# EAGLE design Logomatic (EAGLE 7.4.0)
DESIGNER: Chris Taylor; REVISOR: Revised by: Toni Klopfenstein & Brent Wilkins; VERSION: v2.8

## Sheet 1 of 2
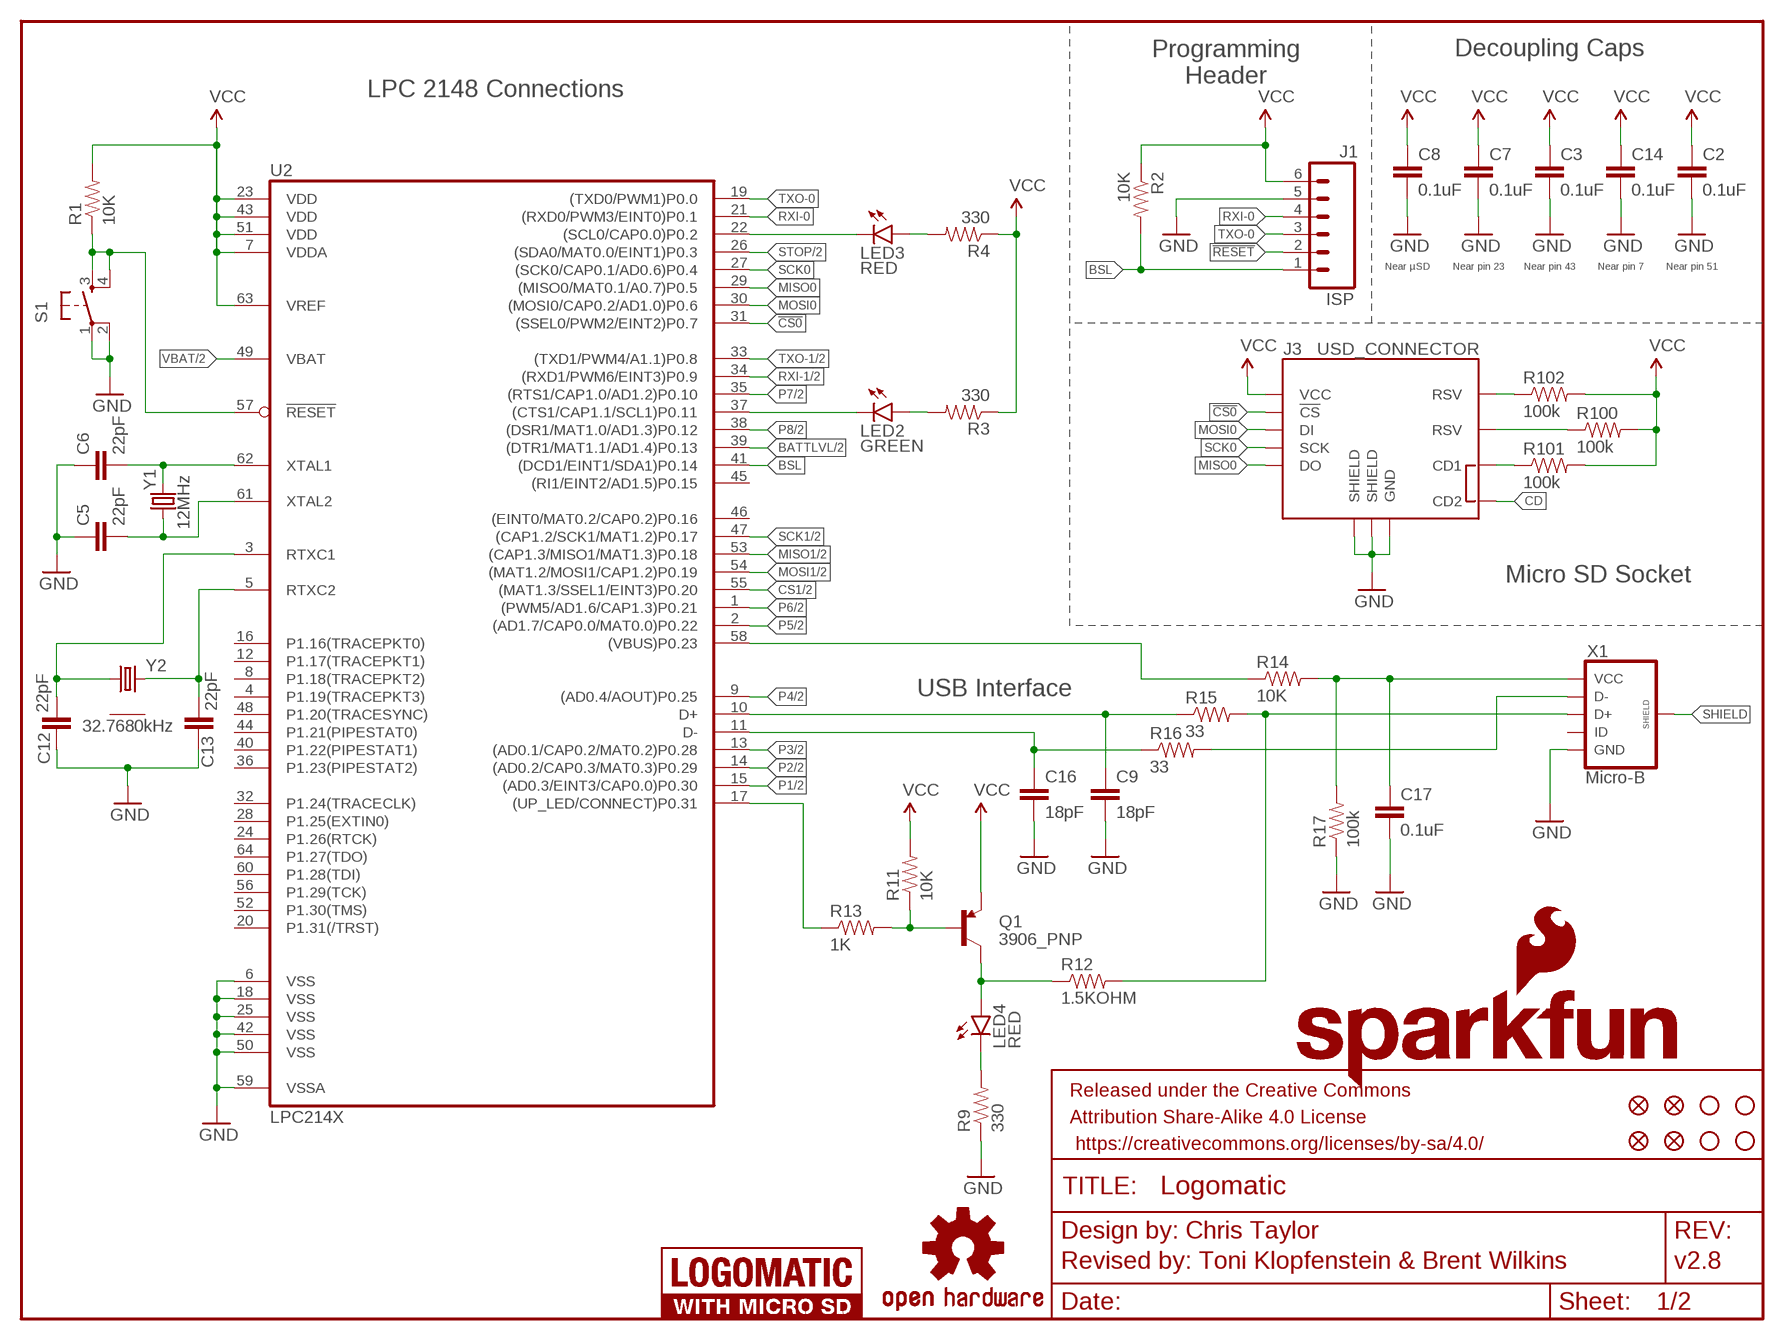
[diagram p0: schematic, sheet 1]

### Parts
C2  0.1uF  0.1UF-25V(+80/-20%)(0603)  [0603-CAP]
C3  0.1uF  0.1UF-25V(+80/-20%)(0603)  [0603-CAP]
C5  22pF  22PF-50V-5%(0603)  [0603-CAP]
C6  22pF  22PF-50V-5%(0603)  [0603-CAP]
C7  0.1uF  0.1UF-25V(+80/-20%)(0603)  [0603-CAP]
C8  0.1uF  0.1UF-25V(+80/-20%)(0603)  [0603-CAP]
C9  18pF  18PF-50V-5%(0603)  [0603-CAP]
C12  22pF  22PF-50V-5%(0603)  [0603-CAP]
C13  22pF  22PF-50V-5%(0603)  [0603-CAP]
C14  0.1uF  0.1UF-25V(+80/-20%)(0603)  [0603-CAP]
C16  18pF  18PF-50V-5%(0603)  [0603-CAP]
C17  0.1uF  0.1UF-25V(+80/-20%)(0603)  [0603-CAP]
FD1  FIDUCIAL1X2  [FIDUCIAL-1X2]
FD2  FIDUCIAL1X2  [FIDUCIAL-1X2]
FD100  FIDUCIAL1X2  [FIDUCIAL-1X2]
FD101  FIDUCIAL1X2  [FIDUCIAL-1X2]
FRAME1  FRAME-LETTER  [CREATIVE_COMMONS]
H1  STAND-OFF  [STAND-OFF]
H2  STAND-OFF  [STAND-OFF]
H3  STAND-OFF  [STAND-OFF]
H4  STAND-OFF  [STAND-OFF]
J1  ISP  M06SILK_FEMALE_PTH  [1X06]
J3  USD_CONNECTOR  [MICRO-SD-SOCKET-PP]
LED2  GREEN  LED-GREEN0603  [LED-0603]
LED3  RED  LED-RED0603  [LED-0603]
LED4  RED  LED-RED0603  [LED-0603]
LOGO1  SFE_LOGO_NAME.1_INCH  [SFE_LOGO_NAME_.1]
LOGO2  SFE_LOGO_FLAME.1_INCH  [SFE_LOGO_FLAME_.1]
LOGO100  OSHW-LOGOL  [OSHW-LOGO-L]
LOGO101  LOGOMATIC_LOGO  [LOGOMATIC_LOGO]
Q1  3906_PNP  TRANSISTOR_PNPPMBT3906  [SOT23-3]
R1  10K  10KOHM-1/10W-1%(0603)0603  [0603-RES]
R2  10K  10KOHM-1/10W-1%(0603)0603  [0603-RES]
R3  330  330OHM1/10W1%(0603)  [0603-RES]
R4  330  330OHM1/10W1%(0603)  [0603-RES]
R9  330  330OHM1/10W1%(0603)  [0603-RES]
R11  10K  10KOHM-1/10W-1%(0603)0603  [0603-RES]
R12  1.5KOHM  1.5KOHM-1/10W-1%(0603)  [0603]
R13  1K  1KOHM-1/10W-1%(0603)  [0603-RES]
R14  10K  10KOHM-1/10W-1%(0603)0603  [0603-RES]
R15  33  33OHM1/10W1%(0603)  [0603-RES]
R16  33  33OHM1/10W1%(0603)  [0603-RES]
R17  100k  100KOHM-1/10W-1%(0603)  [0603-RES]
R100  100k  100KOHM-1/10W-1%(0603)  [0603-RES]
R101  100k  100KOHM-1/10W-1%(0603)  [0603-RES]
R102  100k  100KOHM-1/10W-1%(0603)  [0603-RES]
S1  RESET  TAC_SWITCHSMD  [TACTILE-SWITCH-SMD]
U2  LPC214X  [LQFP-10X10-64]
X1  Micro-B  USB_MICROB_PLUGCONN-11752  [USB-B-MICRO-SMD_V03]
Y1  12MHz  CRYSTALCRYSTAL-SMD-5X3-12MHZ  [CRYSTAL-SMD-5X3]
Y2  32.7680kHz  RTC_CRYSTAL32-SMD  [4-SOJ_5.5MM]

### Nets
!CS0: J3.CS(!CS) U2.31((SSEL0/PWM2/EINT2)P0.7)
!RESET: J1.2 R1.1 S1.3 S1.4 U2.57(!RESET)
BATTLVL: U2.39((DTR1/MAT1.1/AD1.4)P0.13) ; also sheet 2
BSL: J1.1 R2.2 U2.41((DCD1/EINT1/SDA1)P0.14)
CD: J3.CD2
CS1: U2.55((MAT1.3/SSEL1/EINT3)P0.20) ; also sheet 2
GND [power]: C2.2 C3.2 C5.1 C6.1 C7.2 C8.2 C9.2 C12.1 C13.1 C14.2 C16.2 C17.2 J1.5 J3.GND J3.GND1(SHIELD) J3.GND3(SHIELD) R9.1 R17.1 S1.1 S1.2 U2.6(VSS) U2.18(VSS) U2.25(VSS) U2.42(VSS) U2.50(VSS) U2.59(VSSA) X1.GND ; also sheet 2
MISO0: J3.DO U2.29((MISO0/MAT0.1/A0.7)P0.5)
MISO1: U2.53((CAP1.3/MISO1/MAT1.3)P0.18) ; also sheet 2
MOSI0: J3.DI U2.30((MOSI0/CAP0.2/AD1.0)P0.6)
MOSI1: U2.54((MAT1.2/MOSI1/CAP1.2)P0.19) ; also sheet 2
N$3: J3.CD1 R101.1
N$4: J3.RSV1(RSV) R102.1
N$7: LED3.A R4.2
N$10: J3.RSV2(RSV) R100.1
N$17: Q1.1(B) R11.1 R13.2
N$19: LED2.A R3.2
N$33: LED4.C R9.2
P1: U2.15((AD0.3/EINT3/CAP0.0)P0.30) ; also sheet 2
P2: U2.14((AD0.2/CAP0.3/MAT0.3)P0.29) ; also sheet 2
P3: U2.13((AD0.1/CAP0.2/MAT0.2)P0.28) ; also sheet 2
P4: U2.9((AD0.4/AOUT)P0.25) ; also sheet 2
P5: U2.2((AD1.7/CAP0.0/MAT0.0)P0.22) ; also sheet 2
P6: U2.1((PWM5/AD1.6/CAP1.3)P0.21) ; also sheet 2
P7: U2.35((RTS1/CAP1.0/AD1.2)P0.10) ; also sheet 2
P8: U2.38((DSR1/MAT1.0/AD1.3)P0.12) ; also sheet 2
P-D+: C9.1 R15.1 U2.10(D+)
P-D-: C16.1 R16.1 U2.11(D-)
RTXC1: C12.2 U2.3(RTXC1) Y2.1
RTXC2: C13.2 U2.5(RTXC2) Y2.4
RXI-0: J1.4 U2.21((RXD0/PWM3/EINT0)P0.1)
RXI-1: U2.34((RXD1/PWM6/EINT3)P0.9) ; also sheet 2
SCK0: J3.SCLK(SCK) U2.27((SCK0/CAP0.1/AD0.6)P0.4)
SCK1: U2.47((CAP1.2/SCK1/MAT1.2)P0.17) ; also sheet 2
SHIELD: X1.SHIELD1(SHIELD) X1.SHIELD2(SHIELD) X1.SHIELD3(SHIELD)
STAT: LED4.A Q1.3(C) R12.1
STAT0: LED3.C U2.22((SCL0/CAP0.0)P0.2)
STAT1: LED2.C U2.37((CTS1/CAP1.1/SCL1)P0.11)
STOP: U2.26((SDA0/MAT0.0/EINT1)P0.3) ; also sheet 2
TXO-0: J1.3 U2.19((TXD0/PWM1)P0.0)
TXO-1: U2.33((TXD1/PWM4/A1.1)P0.8) ; also sheet 2
UP_LED: R13.1 U2.17((UP_LED/CONNECT)P0.31)
USB_D+: R12.2 R15.2 X1.D+
USB_D-: R16.2 X1.D-
USB_VIN: C17.1 R14.2 R17.2 X1.VBUS(VCC) ; also sheet 2
VBAT: U2.49(VBAT) ; also sheet 2
VBUS: R14.1 U2.58((VBUS)P0.23)
VCC: C2.1 C3.1 C7.1 C8.1 C14.1 J1.6 J3.VCC Q1.2(E) R1.2 R2.1 R3.1 R4.1 R11.2 R100.2 R101.2 R102.2 U2.7(VDDA) U2.23(VDD) U2.43(VDD) U2.51(VDD) U2.63(VREF) ; also sheet 2
XTAL1: C6.2 U2.62(XTAL1) Y1.3
XTAL2: C5.2 U2.61(XTAL2) Y1.1
Unconnected: U2.4(P1.19(TRACEPKT3)) U2.8(P1.18(TRACEPKT2)) U2.12(P1.17(TRACEPKT1)) U2.16(P1.16(TRACEPKT0)) U2.20(P1.31(/TRST)) U2.24(P1.26(RTCK)) U2.28(P1.25(EXTIN0)) U2.32(P1.24(TRACECLK)) U2.36(P1.23(PIPESTAT2)) U2.40(P1.22(PIPESTAT1)) U2.44(P1.21(PIPESTAT0)) U2.45((RI1/EINT2/AD1.5)P0.15) U2.46((EINT0/MAT0.2/CAP0.2)P0.16) U2.48(P1.20(TRACESYNC)) U2.52(P1.30(TMS)) U2.56(P1.29(TCK)) U2.60(P1.28(TDI)) U2.64(P1.27(TDO)) X1.ID Y2.2 Y2.3

### Notes on the sheet
- Decoupling Caps
- Programming
  Header
- LPC 2148 Connections
- Near µSD | Near pin 23 | Near pin 43 | Near pin 7 | Near pin 51
- Micro SD Socket
- USB Interface

## Sheet 2 of 2
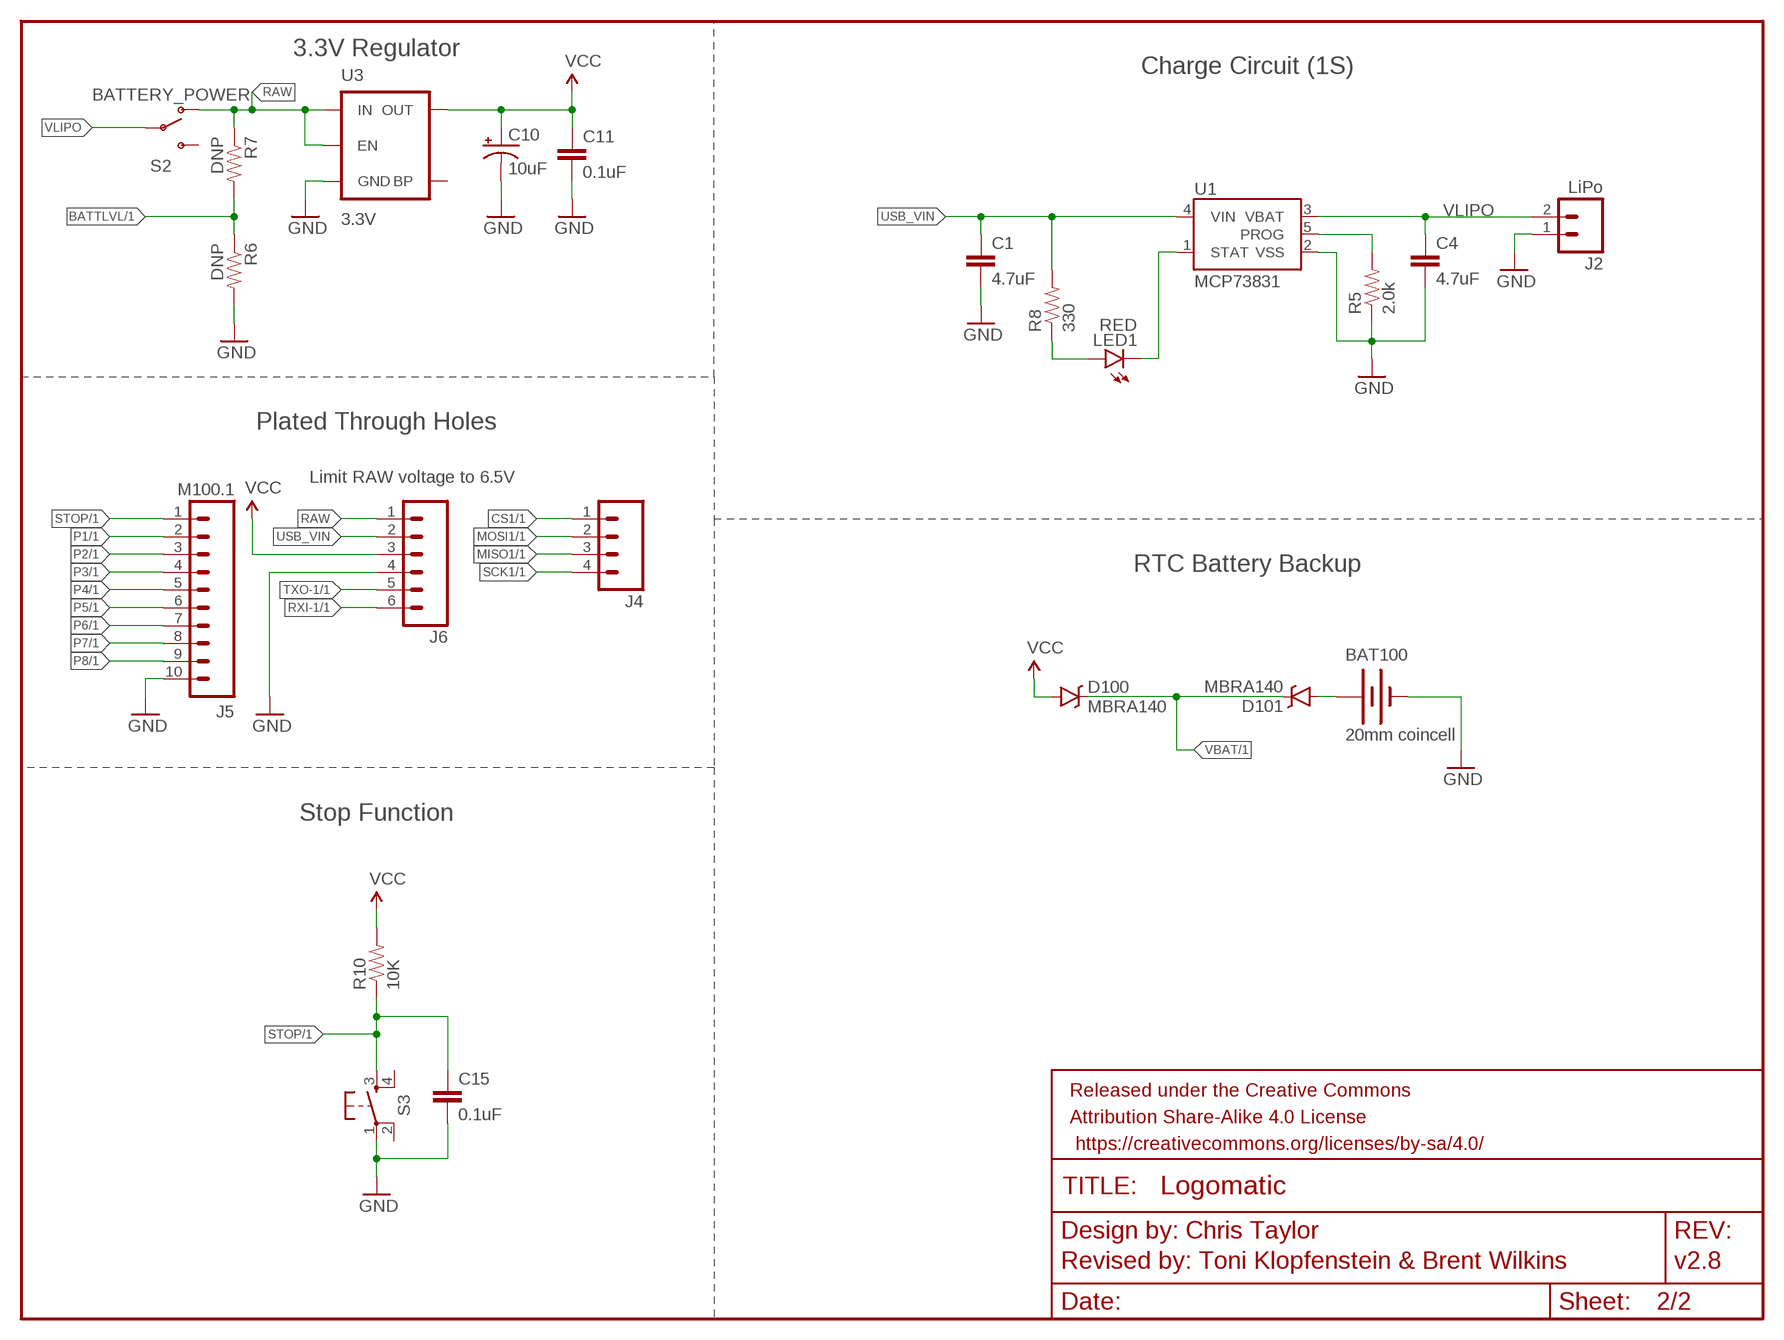
[diagram p1: schematic, sheet 2]

### Parts
BAT100  20mm coincell  BATTERY20MM_4LEGS  [BATTCON_20MM_4LEGS]
C1  4.7uF  4.7UF-6.3V-10%(0603)0603  [0603-CAP]
C4  4.7uF  4.7UF-6.3V-10%(0603)0603  [0603-CAP]
C10  10uF  10UF-16V-10%(TANT)  [EIA3216]
C11  0.1uF  0.1UF-25V(+80/-20%)(0603)  [0603-CAP]
C15  0.1uF  0.1UF-25V(+80/-20%)(0603)  [0603-CAP]
D100  MBRA140  [SMA-DIODE]
D101  MBRA140  [SMA-DIODE]
FRAME2  FRAME-LETTERNO_PACKAGE  [DUMMY]
J2  LiPo  M02-JST-2MM-SMT  [JST-2-SMD]
J4  M04PTH  [1X04]
J5  M100.1  M10SILK_FEMALE_PTH  [1X10]
J6  M06SILK_FEMALE_PTH  [1X06]
LED1  RED  LED-RED0603  [LED-0603]
R5  2.0k  2.0KOHM1/10W5%(0603)  [0603-RES]
R6  DNP  1MOHM-1/10W-1%(0603)  [0603-RES]
R7  DNP  1MOHM-1/10W-1%(0603)  [0603-RES]
R8  330  330OHM1/10W1%(0603)  [0603-RES]
R10  10K  10KOHM-1/10W-1%(0603)0603  [0603-RES]
S2  BATTERY_POWER  SWITCH-SPDTSMD  [AYZ0202]
S3  TAC_SWITCHSMD  [TACTILE-SWITCH-SMD]
U1  MCP73831  [SOT23-5]
U3  3.3V  MIC52053.3V  [SOT23-5]

### Nets
BATTLVL: R6.1 R7.2 ; also sheet 1
CS1: J4.1 ; also sheet 1
GND [power]: BAT100.NEGATIVE(-) C1.2 C4.2 C10.C(-) C11.2 C15.2 J2.1 J5.10 J6.4 R5.1 R6.2 S3.1 U1.2(VSS) U3.2(GND) ; also sheet 1
MISO1: J4.3 ; also sheet 1
MOSI1: J4.2 ; also sheet 1
N$1: R5.2 U1.5(PROG)
N$2: BAT100.POSITIVE@1(+) BAT100.POSITIVE@2(+) BAT100.POSITIVE@3(+) BAT100.POSITIVE@4(+) D101.A
N$12: LED1.C U1.1(STAT)
N$13: LED1.A R8.1
P1: J5.2 ; also sheet 1
P2: J5.3 ; also sheet 1
P3: J5.4 ; also sheet 1
P4: J5.5 ; also sheet 1
P5: J5.6 ; also sheet 1
P6: J5.7 ; also sheet 1
P7: J5.8 ; also sheet 1
P8: J5.9 ; also sheet 1
RAW: J6.1 R7.1 S2.1(O) U3.1(IN) U3.3(EN)
RXI-1: J6.6 ; also sheet 1
SCK1: J4.4 ; also sheet 1
STOP: C15.1 J5.1 R10.1 S3.3 ; also sheet 1
TXO-1: J6.5 ; also sheet 1
USB_VIN: C1.1 J6.2 R8.2 U1.4(VIN) ; also sheet 1
VBAT: D100.C D101.C ; also sheet 1
VCC: C10.A(+) C11.1 D100.A J6.3 R10.2 U3.5(OUT) ; also sheet 1
VLIPO [power]: C4.1 J2.2 S2.2(P) U1.3(VBAT)
Unconnected: S2.3(S) S3.2 S3.4 U3.4(BP)

### Notes on the sheet
- 3.3V Regulator
- Charge Circuit (1S)
- Plated Through Holes
- Limit RAW voltage to 6.5V
- RTC Battery Backup
- Stop Function

## Library data of the parts
BAT100 = SparkFun-Electromechanical:BATTERY: Battery Holders Various common sizes : AA, AAA, 18650 (PRT-12895), 20mm coin cell and 12mm coin cell. 20MM_4LEGS, BATT-10373; PROD_ID: BATT-10373
C1 C4 = SparkFun-Capacitors:4.7UF-6.3V-10%(0603): CAP-08280; PROD_ID: CAP-08280
C2 C3 C7 C8 C11 C14 C15 C17 = SparkFun-Capacitors:0.1UF-25V(+80/-20%)(0603): CAP-00810 Ceramic Standard decoupling cap; PROD_ID: CAP-00810
C5 C6 C12 C13 = SparkFun-Capacitors:22PF-50V-5%(0603): CAP-07876; PROD_ID: CAP-07876
C9 C16 = SparkFun-Capacitors:18PF-50V-5%(0603): CAP-08267; PROD_ID: CAP-08267
C10 = SparkFun-Capacitors:10UF-16V-10%(TANT): CAP-00811 1206/EIA-3216 Tantalum capacitor; PROD_ID: CAP-00811
D100 D101 = SparkFun-DiscreteSemi:MBRA140: 40V, 1A Schottky rectifier SMA/DO-214AC package DIO-08053; PROD_ID: DIO-08053
FD1 FD2 FD100 FD101 = SparkFun-Aesthetics:FIDUCIAL: Fiducial Alignment Points Various fiducial points for machine vision alignment.
FRAME1 = SparkFun-Aesthetics:FRAME-LETTER: Schematic Frame Standard 8.5x11 US Letter frame
FRAME2 = SparkFun-Aesthetics:FRAME-LETTER: Schematic Frame Standard 8.5x11 US Letter frame; DESIGNER: Nobody; VERSION: v01
H1-H4 = SparkFun-Electromechanical:STAND-OFF: #4 Stand Off This is the mechanical footprint for a #4 phillips button head screw. Use the keepout ring to avoid running the screw head into surrounding components. SKU : PRT-00447
J1 J6 = SparkFun-Connectors:M06: Header 6 Standard 6-pin 0.1" header. Use with straight break away headers (SKU : PRT-00116), right angle break away headers (PRT-00553), swiss pins (PRT-00743), machine pins (PRT-00117), and female headers (PRT-00115). Molex polarized connector foot print use with SKU : PRT-08094 with associated crimp pins and housings. NOTES ON THE VARIANTS LOCK and LOCK_LONGPADS... This footprint was designed to help hold the alignment of a through-hole component (i.e. 6-pin header) while soldering it into place. You may notice that each hole has been shifted either up or down by 0.005 of an inch from it's more standard position (which is a perfectly straight line). This slight alteration caused the pins (the squares in the middle) to touch the edges of the holes. Because they are alternating, it causes a "brace" to hold the component in place. 0.005 has proven to be the perfect amount of "off-center" position when using our standard breakaway headers. Although looks a little odd when you look at the bare footprint, once you have a header in there, the alteration is very hard to notice. Also,if you push a header all the way into place, it is covered up entirely on the bottom side. This idea of altering the position of holes to aid alignment will be further integrated into the Sparkfun Library for other footprints. It can help hold any component with 3 or more connection pins.; PROD_ID: CONN-08437
J2 = SparkFun-Connectors:M02: Standard 2-pin 0.1" header. Use with - straight break away headers ( PRT-00116) - right angle break away headers (PRT-00553) - swiss pins (PRT-00743) - machine pins (PRT-00117) - female headers (PRT-00115) Molex polarized connector foot print use with: PRT-08233 with associated crimp pins and housings. 2.54_SCREWTERM for use with PRT-10571. 3.5mm Screw Terminal footprints for PRT-08084 5mm Screw Terminal footprints for use with PRT-08432; PROD_ID: CONN-11443
J3 = SparkFun-Connectors:USD_CONNECTOR: microSD Socket Push-push type µSD socket. Footprint production proven. Symbol has new and improved layout and naming accuracy. SparkFun Electronics SKU : PRT-00127. tDoc lines correctly indicate media card edge positions when inserting (unlocked, locked, depressed). NOTE: CD1 and CD2 are connected internally; PROD_ID: CONN-07820
J4 = SparkFun-Connectors:M04: Header 4 Standard 4-pin 0.1" header. Use with straight break away headers (SKU : PRT-00116), right angle break away headers (PRT-00553), swiss pins (PRT-00743), machine pins (PRT-00117), and female headers (PRT-00115). Molex polarized connector foot print use with SKU : PRT-08231 with associated crimp pins and housings. 1MM SMD Version SKU: PRT-10208; PROD_ID: CONN-09696
J5 = SparkFun-Connectors:M10: Header 10 Standard 10-pin 0.1" header. Use with straight break away headers (SKU : PRT-00116), right angle break away headers (PRT-00553), swiss pins (PRT-00743), machine pins (PRT-00117), and female headers (PRT-00115).; PROD_ID: CONN-11563
LED1 LED3 LED4 = SparkFun-LED:LED-RED: Assorted Red LEDs LilyPad 1206- DIO-09912 1206- DIO-00809 0603- DIO-00819 "SMART" means more efficient and expensive; PROD_ID: DIO-00819
LED2 = SparkFun-LED:LED-GREEN: Various green LEDs Green LEDs used in SFE Production 0603- DIO-00821 LARGE- DIO-00862 LILYPAD- DIO-09910; PROD_ID: DIO-00821
LOGO1 = SparkFun-Aesthetics:SFE_LOGO_NAME: SFE Logo, name only This is the SparkFun name logo. The logo on the schematic will always be the same size; the package variant is the height of the flame part of the logo (or the height the flame would be, if it were drawn). Default layer for the logo on the board is tSilk.
LOGO2 = SparkFun-Aesthetics:SFE_LOGO_FLAME: SFE Logo, flame only This is the SparkFun flame logo. The logo on the schematic will always be the same size; the package variant is the height of the flame. Default layer for the logo on the board is tSilk.
LOGO100 = SparkFun-Aesthetics:OSHW-LOGO: Open Source Hardware Logo This logo indicates the piece of hardware it is found on incorporates a OSHW license and/or adheres to the definition of open source hardware found here: http://freedomdefined.org/OSHW
LOGO101 = SparkFun-Aesthetics:LOGOMATIC_LOGO: Logo for the Logomatic boards. Silk is .4" by 1.1" Board logo is .4" by 1.1"
Q1 = SparkFun-DiscreteSemi:TRANSISTOR_PNP: Generic PNP BJT Double check pinouts against datasheets- not all devices are the same! MMBT3906 - 40V 200mA SOT-23 (TRANS-08052) MMBT4403 - 40V 600mA SOT-23 (TRANS-09245); PROD_ID: TRANS-08052; VALUE: PMBT3906
R1 R2 R10 R11 R14 = SparkFun-Resistors:10KOHM-1/10W-1%(0603): RES-00824; PROD_ID: RES-00824
R3 R4 R8 R9 = SparkFun-Resistors:330OHM1/10W1%(0603): RES-00818; PROD_ID: RES-00818
R5 = SparkFun-Resistors:2.0KOHM1/10W5%(0603): RES-08296; PROD_ID: RES-08296
R6 R7 = SparkFun-Resistors:1MOHM-1/10W-1%(0603): RES-07868; PROD_ID: RES-07868; VALUE: 1M
R12 = SparkFun-Resistors:1.5KOHM-1/10W-1%(0603): RES-08306; PROD_ID: RES-08306
R13 = SparkFun-Resistors:1KOHM-1/10W-1%(0603): RES-07856; PROD_ID: RES-07856
R15 R16 = SparkFun-Resistors:33OHM1/10W1%(0603): RES-08270; PROD_ID: RES-08270
R17 R100-R102 = SparkFun-Resistors:100KOHM-1/10W-1%(0603): RES-07828; PROD_ID: RES-07828
S1 = SparkFun-Retired:TAC_SWITCH: Momentary Switch Button commonly used for reset or general input. Spark Fun Electronics SKU : COM-00097 SMT- SWCH-08247; PROD_ID: SWCH-08247; VALUE: TAC_SWITCHSMD
S2 = SparkFun-Electromechanical:SWITCH-SPDT: SPDT Switch Simple slide switch, Spark Fun Electronics SKU : COM-00102 DPDT SMT slide switch, AYZ0202, SWCH-08179; PROD_ID: SWCH-08179; SF_ID: COM-00597
S3 = SparkFun-Retired:TAC_SWITCH: Momentary Switch Button commonly used for reset or general input. Spark Fun Electronics SKU : COM-00097 SMT- SWCH-08247; PROD_ID: SWCH-08247
U1 = SparkFun-PowerIC:MCP73831: Miniature single cell, fully integrated Li-Ion, Li-polymer charge management controller http://ww1.microchip.com/downloads/en/DeviceDoc/20001984g.pdf IC-09995; PROD_ID: IC-09995
U2 = SparkFun-DigitalIC:LPC214X: LPC214x Schematic element and footprint for NXP LPC2144/2146/2148.; PROD_ID: IC-07934
U3 = SparkFun-PowerIC:MIC5205: MIC5205 150mA vreg 3.3V - VREG-00822 5V - VREG-00823; PROD_ID: VREG-00822
X1 = SparkFun-Connectors:USB_MICROB_PLUG: USB Micro-B connectors Some male, some female. Watch your step!; PROD_ID: CONN-11752
Y1 = SparkFun-FreqCtrl:CRYSTAL: Various standard crystals. Proven footprints.; PROD_ID: XTAL-08297
Y2 = Logomatic_testing:RTC_CRYSTAL: Various standard crystals. Proven footprints.; PROD_ID: XTAL-13225

## Net classes
0 default: width 0.178 mm
2 hv: clearance 0.229 mm

## Board
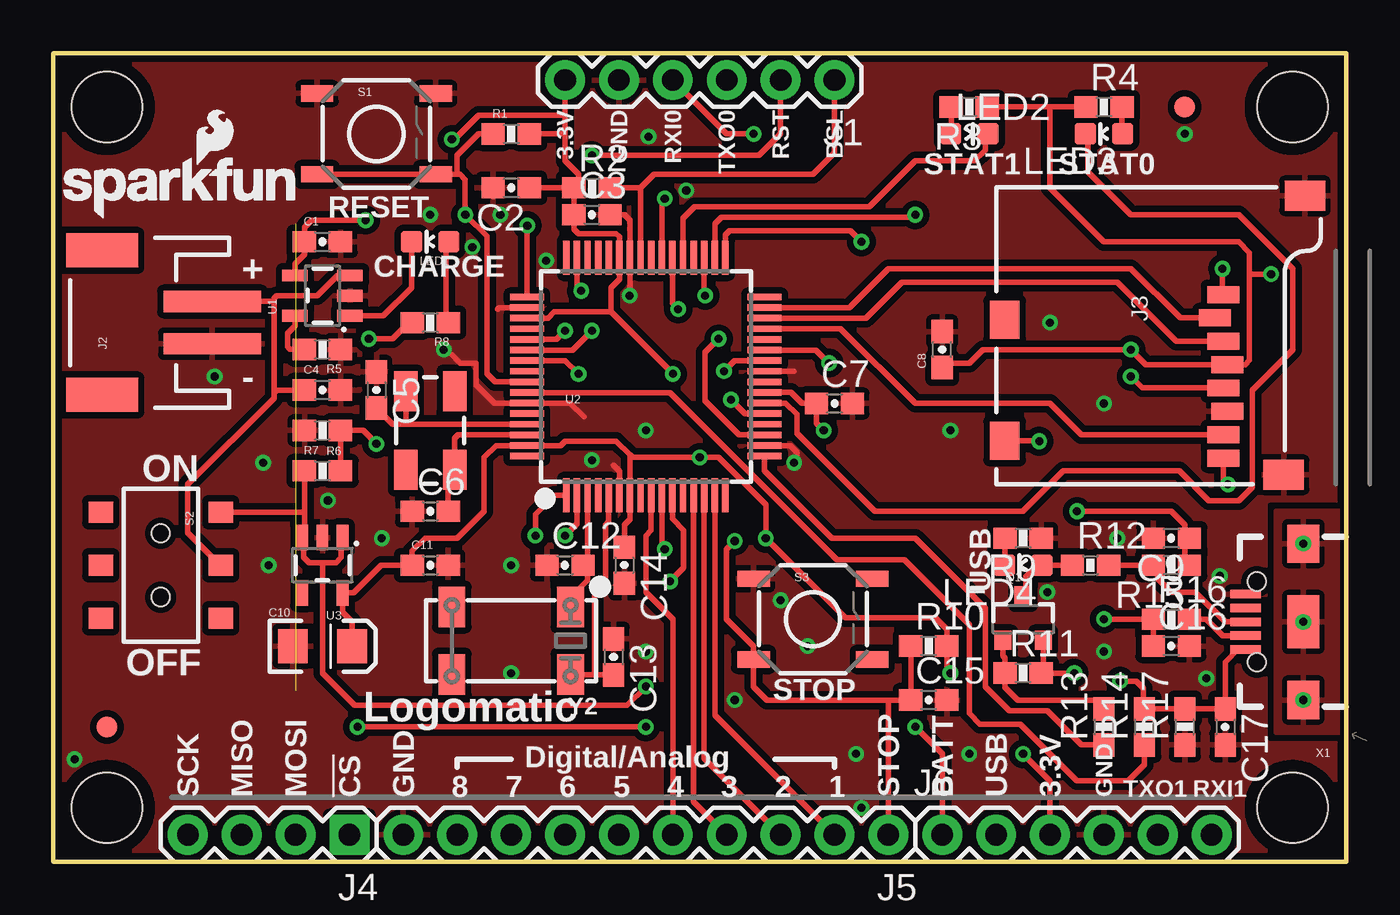
[diagram p2: board, top side]
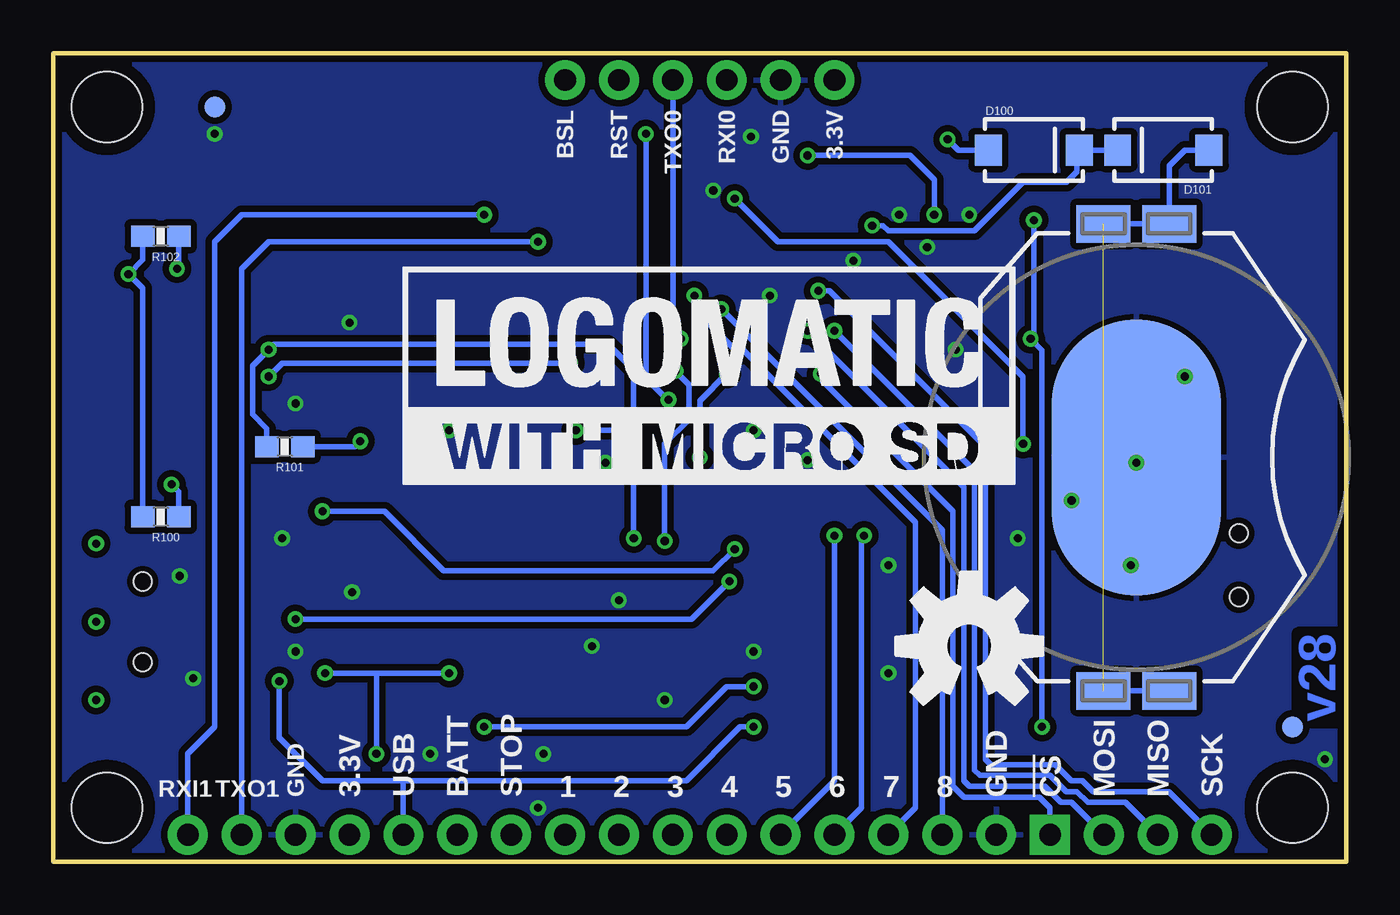
[diagram p3: board, bottom side, seen from below]

Size 60.96 x 38.1 mm. Coordinates in mm from the lower left corner, seen from the top.
Outline: 0,0 60.96,0 60.96,38.1 0,38.1 0,0
Copper layers (1*16): Top 0.035mm / dielectric 1.5mm / Bottom 0.035mm
Design rules "SparkFun-2-layer-TIGHT *": minimum track width 7mil, minimum drill 15mil, track to track 7mil, track to pad 7mil, pad to pad 7mil, via to via 7mil, smd to smd 7mil, copper to edge 7mil, drill to drill 7mil, minimum pad ring 7mil, minimum via ring 7mil, stop-mask expansion 4mil, vias tented up to drill 20mil, thermal gap 10mil

### Footprints (pad centres in the part's own frame; a part is rotated, then mirrored left to right if it is on the bottom)
BATTCON_20MM_4LEGS = smd 13 x 8: NEGATIVE 0,0 | smd 1.778 x 2.54: POSITIVE@1 -11,1.55; POSITIVE@2 -11,-1.55; POSITIVE@3 11,-1.55; POSITIVE@4 11,1.55
0603-CAP = smd 1.1 x 1: 1 -0.85,0; 2 0.85,0
EIA3216 = smd 1.4 x 1.6: A 1.4,0; C -1.4,0
SMA-DIODE = smd 1.27 x 1.47: A -2.15,0; C 2.15,0
FIDUCIAL-1X2 = smd 1 x 1: 1 0,0
STAND-OFF = hole 3.302: 0,0
1X06 = drill 1.016 pad 1.88: 1 0,0; 2 2.54,0; 3 5.08,0; 4 7.62,0; 5 10.16,0; 6 12.7,0
JST-2-SMD = smd 1 x 4.6: 1 -1,-3.7; 2 1,-3.7 | smd 1.6 x 3.4: NC1 -3.4,1.5; NC2 3.4,1.5
MICRO-SD-SOCKET-PP = smd 1.8 x 1.4: CD1 -2.05,0.4; CD2 -7.75,0.4 | smd 0.8 x 1.5: CS -7.84,10.3; DI -6.74,10.7; DO -2.34,10.7; GND -3.44,10.9; RSV1 -8.94,10.7; RSV2 -1.24,10.7; SCLK -4.54,10.7; VCC -5.64,10.9 | smd 1.4 x 1.9: GND1 -13.6,14.55; GND3 -0.45,13.55
1X04 = drill 1.016 pad 1.88 square: 1 0,0 | drill 1.016 pad 1.88: 2 2.54,0; 3 5.08,0; 4 7.62,0
1X10 = drill 1.016 pad 1.88: 1 0,0; 2 2.54,0; 3 5.08,0; 4 7.62,0; 5 10.16,0; 6 12.7,0; 7 15.24,0; 8 17.78,0; 9 20.32,0; 10 22.86,0
LED-0603 = smd 1 x 1: A 0,-0.877; C 0,0.877
SOT23-3 = smd 0.8 x 0.9: 1 -0.95,-1; 2 0.95,-1; 3 0,1.1
0603-RES = smd 1.1 x 1: 1 -0.85,0; 2 0.85,0
0603 = smd 1.1 x 1: 1 -0.85,0; 2 0.85,0
TACTILE-SWITCH-SMD = smd 1.524 x 0.762: 1 -2.794,1.905; 2 2.794,1.905; 3 -2.794,-1.905; 4 2.794,-1.905
AYZ0202 = smd 1 x 1.15: 1 -2.5,2.825; 2 0,2.825; 3 2.5,2.825; 4 -2.5,-2.825; 5 0,-2.825; 6 2.5,-2.825 | hole 0.85: 1.5,0; -1.5,0
SOT23-5 = smd 0.55 x 1.2: 1 -0.95,-1.3; 2 0,-1.3; 3 0.95,-1.3; 4 0.95,1.3; 5 -0.95,1.3
LQFP-10X10-64 = smd 0.3 x 1.6: 1 -3.75,-5.6; 2 -3.25,-5.6; 3 -2.75,-5.6; 4 -2.25,-5.6; 5 -1.75,-5.6; 6 -1.25,-5.6; 7 -0.75,-5.6; 8 -0.25,-5.6; 9 0.25,-5.6; 10 0.75,-5.6; 11 1.25,-5.6; 12 1.75,-5.6; 13 2.25,-5.6; 14 2.75,-5.6; 15 3.25,-5.6; 16 3.75,-5.6; 33 3.75,5.6; 34 3.25,5.6; 35 2.75,5.6; 36 2.25,5.6; 37 1.75,5.6; 38 1.25,5.6; 39 0.75,5.6; 40 0.25,5.6; 41 -0.25,5.6; 42 -0.75,5.6; 43 -1.25,5.6; 44 -1.75,5.6; 45 -2.25,5.6; 46 -2.75,5.6; 47 -3.25,5.6; 48 -3.75,5.6 | smd 1.6 x 0.3: 17 5.6,-3.75; 18 5.6,-3.25; 19 5.6,-2.75; 20 5.6,-2.25; 21 5.6,-1.75; 22 5.6,-1.25; 23 5.6,-0.75; 24 5.6,-0.25; 25 5.6,0.25; 26 5.6,0.75; 27 5.6,1.25; 28 5.6,1.75; 29 5.6,2.25; 30 5.6,2.75; 31 5.6,3.25; 32 5.6,3.75; 49 -5.6,3.75; 50 -5.6,3.25; 51 -5.6,2.75; 52 -5.6,2.25; 53 -5.6,1.75; 54 -5.6,1.25; 55 -5.6,0.75; 56 -5.6,0.25; 57 -5.6,-0.25; 58 -5.6,-0.75; 59 -5.6,-1.25; 60 -5.6,-1.75; 61 -5.6,-2.25; 62 -5.6,-2.75; 63 -5.6,-3.25; 64 -5.6,-3.75
USB-B-MICRO-SMD_V03 = smd 1.45 x 0.4: D+ 2.725,0; D- 2.725,0.65; GND 2.725,-1.3; ID 2.725,-0.65; VBUS 2.725,1.3 | smd 1.5 x 1.8: SHIELD1 0,3.685; SHIELD2 0,-3.685 | smd 1.5 x 2.5: SHIELD3 0,0 | hole 0.85: 2.2,1.9; 2.2,-1.9
CRYSTAL-SMD-5X3 = smd 1.9 x 1.1: 1 -1.85,-1.15; 2 1.85,-1.15; 3 1.85,1.15; 4 -1.85,1.15
4-SOJ_5.5MM = smd 1.27 x 1.905: 1 -2.794,-1.587; 2 2.794,-1.587; 3 2.794,1.587; 4 -2.794,1.587

### Placement (x,y rotation side)
BAT100  9.91,19.05 90 bottom
C1  12.7,29.21 0 top
C2  21.59,31.75 180 top
C3  25.4,30.48 0 top
C4  12.7,22.23 0 top
C5  15.24,22.23 270 top
C6  17.78,16.51 0 top
C7  36.83,21.59 0 top
C8  41.91,24.13 90 top
C9  52.7,15.24 180 top
C10  12.7,10.16 0 top
C11  17.78,13.97 0 top
C12  24.13,13.97 0 top
C13  26.42,9.65 270 top
C14  26.92,13.97 270 top
C15  41.27,7.62 0 top
C16  52.7,10.16 0 top
C17  55.24,6.35 270 top
D100  14.73,33.53 0 bottom
D101  8.64,33.53 180 bottom
FD1  53.34,35.56 0 top
FD2  2.54,6.35 0 top
FD100  2.54,6.35 0 bottom
FD101  53.34,35.56 0 bottom
FRAME1  -0.49,-19.3 0 top  (outside the outline)
FRAME2  7.66,-19.56 0 top  (outside the outline)
H1  2.54,35.56 0 top
H2  58.42,35.56 0 top
H3  2.54,2.54 0 top
H4  58.42,2.54 0 top
J1  36.83,36.83 180 top
J2  3.81,25.4 90 top
J3  44.45,17.78 270 top
J4  13.97,1.27 180 top
J5  39.37,1.27 180 top
J6  41.91,1.27 0 top
LED1  17.78,29.21 90 top
LED2  43.18,34.29 270 top
LED3  49.53,34.29 90 top
LED4  45.72,13.97 90 top
LOGO1  0,29.84 0 top
LOGO2  6.48,32.51 0 top
LOGO100  17.78,10.16 0 bottom
LOGO101  44.45,17.78 0 bottom
Q1  45.72,11.43 0 top
R1  21.59,34.29 0 top
R2  25.4,31.75 0 top
R3  43.18,35.56 180 top
R4  49.53,35.56 0 top
R5  12.7,24.13 180 top
R6  12.7,20.32 180 top
R7  12.7,18.41 0 top
R8  17.78,25.4 180 top
R9  45.72,15.24 180 top
R10  41.27,10.16 0 top
R11  45.72,8.89 0 top
R12  48.9,13.97 0 top
R13  49.53,6.35 90 top
R14  51.44,6.35 90 top
R15  52.7,13.97 180 top
R16  52.7,11.43 0 top
R17  53.34,6.35 90 top
R100  55.88,16.26 180 bottom
R101  50.04,19.56 180 bottom
R102  55.88,29.46 180 bottom
S1  15.24,34.29 0 top
S2  5.08,13.97 270 top
S3  35.81,11.43 0 top
U1  12.7,26.67 90 top
U2  27.94,22.86 0 top
U3  12.7,13.97 180 top
X1  58.93,11.3 180 top
Y1  17.78,20.32 270 top
Y2  21.59,10.41 180 top

### Tracks (layer width: path | path; a pad name or v marks a point on that pad's centre or on a via)
!CS0
  Top 0.254: J3.CS 53.12,25.62 50.8,27.94 39.37,27.94 37.54,26.11 U2.31
!RESET  (via drill 0.38)
  Top 0.254: v25.4,33.27 33.27,33.27 34.29,34.29 J1.2 | 19.05,32.38 19.18,32.38 19.43,32.13 v19.43,30.48 20.45,29.46 20.45,22.99 20.83,22.61 22.1,22.61 U2.57 | 19.05,32.38 19.05,33.27 20.07,34.29 R1.1 | S1.3 S1.4 19.05,32.38
  Bottom 0.254: v25.4,33.27 20.57,33.27 19.43,32.13 v19.43,30.48
BATTLVL  (via drill 0.38)
  Top 0.254: R7.2 R6.1 14.61,20.32 v15.24,19.68 | U2.39 28.69,31.1 v28.83,31.24
  Bottom 0.254: v28.83,31.24 26.8,29.21 21.59,29.21 15.24,22.86 v15.24,19.68
BSL
  Top 0.254: J1.1 36.83,33.4 35.81,32.38 28.32,32.38 27.69,31.75 | 27.69,31.75 27.69,28.45 U2.41 | 27.69,31.75 R2.2
CS1  (via drill 0.38)
  Top 0.254: v24.77,22.99 24.14,23.61 U2.55
  Bottom 0.254: J4.1 13.97,2.54 14.48,3.05 18.03,3.05 18.54,3.56 18.54,16.51 24.77,22.73 v24.77,22.99
GND  (via drill 0.38)
  Top 0.254: U2.25 34.92,23.11 | v27.18,26.67 27.19,26.68 U2.42 27.19,30.21 26.92,30.48 C3.2 26.04,30.48 | U2.6 26.69,18.39 26.42,18.67 | U2.18 34.75,19.61 35.05,19.3 35.05,18.8 v34.92,18.8 | 25.02,20.95 24.36,21.61 U2.59 20.81,21.61 19.94,22.48 19.94,23.5 19.18,23.5 18.8,23.88 | C2.2 20.74,31.33 | U2.50 21.03,26.11 20.95,26.04
  other vias: 27.94,9.91 53.34,34.29 18.41,24.13 21.08,30.48 49.53,9.91 35.56,10.16 27.94,20.32 10.16,13.97 25.4,18.92 42.29,20.32 21.59,13.97 7.62,22.86 43.18,5.08 50.16,15.24 9.91,18.8 46.99,25.4 49.53,21.59 17.78,30.48 12.95,17.02 21.59,8.89 54.99,13.46 23.24,28.32 19.76,28.96 15.49,15.24 1.02,4.83 37.85,5.08 32.13,7.62 38.1,2.54 34.29,12.32 46.86,12.7 54.36,8.64 28.07,34.16 29.84,31.62
  pour Top (isolate 0.305, rank 6): 0,0 60.96,0 60.96,38.1 0,38.1
  pour Bottom (isolate 0.305): 0,0 60.96,0 60.96,38.1 0,38.1
MISO0
  Top 0.254: J3.DO 48.46,20.12 46.99,21.59 40.64,21.59 37.12,25.11 U2.29
MISO1  (via drill 0.38)
  Top 0.254: v24.13,25.02 23.72,24.61 U2.53
  Bottom 0.254: v24.13,25.02 17.53,18.41 17.53,4.32 17.27,4.06 13.97,4.06 13.21,3.3 12.7,3.3 12.19,2.79 10.41,2.79 J4.3
MOSI0
  Top 0.254: J3.DI 52.95,24.52 50.16,27.3 40.01,27.3 38.31,25.61 U2.30
MOSI1  (via drill 0.38)
  Top 0.254: v25.4,25.02 24.49,24.11 U2.54
  Bottom 0.254: v25.4,25.02 18.35,17.97 18.03,17.65 18.03,3.81 17.78,3.56 14.22,3.56 13.46,2.79 12.95,2.79 J4.2
N$1
  Top 0.254: 12.05,24.14 11.87,24.14 | 11.87,24.14 R5.2 | 11.87,24.14 11.16,24.14 11.05,24.26 11.05,24.89 11.4,25.24 U1.5
N$2  (1 unrouted)
  Bottom 0.254: D101.A 7.62,33.53 8.36,32.79 BAT100.POSITIVE@3 BAT100.POSITIVE@4 | BAT100.POSITIVE@2 BAT100.POSITIVE@1
N$3  (via drill 0.38)
  Top 0.254: J3.CD1 46.48,19.83 v46.48,19.81
  Bottom 0.254: v46.48,19.81 46.74,19.56 R101.1
N$4  (via drill 0.38)
  Top 0.254: J3.RSV1 55.12,26.75 v55.12,27.94
  Bottom 0.254: v55.12,27.94 55.03,28.03 R102.1
N$7
  Top 0.254: R4.2 50.38,34.32 LED3.A
N$10  (via drill 0.38)
  Top 0.254: J3.RSV2 55.15,17.78 v55.37,17.78
  Bottom 0.254: v55.37,17.78 55.03,17.44 R100.1
N$12
  Top 0.254: U1.1 15.56,25.72 16.89,27.05 16.89,29.2 LED1.C
N$13
  Top 0.254: R8.1 18.53,25.5 18.53,29.08 LED1.A
N$17
  Top 0.254: 49.49,7.24 R13.2 49.11,7.62 45.47,7.62 44.87,8.22 R11.1 44.87,9.61 44.77,9.71 Q1.1
N$19
  Top 0.254: R3.2 42.33,34.32 LED2.A
N$33
  Top 0.254: R9.2 44.87,14 LED4.C
P1
  Top 0.254: U2.15 31.19,6.91 J5.2
P2
  Top 0.254: 30.69,17.36 U2.14 30.69,4.87 J5.3
P3
  Top 0.254: U2.13 30.19,2.83 J5.4
P4
  Top 0.254: U2.9 28.19,15.62 27.94,15.37 27.94,12.7 29.21,11.43 J5.5
P5  (via drill 0.38)
  Top 0.254: U2.2 24.69,15.93 v24.13,15.37
  Bottom 0.254: v24.13,15.37 24.13,3.81 J5.6
P6  (via drill 0.38)
  Top 0.254: 24.18,17.27 U2.1 23.61,17.26 22.73,16.38 v22.73,15.37
  Bottom 0.254: v22.73,15.37 22.86,15.24 22.86,2.54 J5.7
P7  (via drill 0.38)
  Top 0.254: 30.69,28.49 U2.35 30.69,26.71 v30.73,26.67
  Bottom 0.254: v30.73,26.67 30.73,26.04 28.83,24.13 28.45,24.13 20.32,16 20.32,2.54 J5.8
P8  (via drill 0.38)
  Top 0.254: U2.38 29.19,26.31 v29.46,26.04
  Bottom 0.254: J5.9 19.05,15.62 v29.46,26.04
P-D+  (via drill 0.38)
  Top 0.254: U2.10 28.69,14.87 v28.83,14.73 | v48.26,16.51 52.7,16.51 53.34,15.88 53.34,15.46 C9.1 53.34,15.03 53.34,13.97 R15.1
  Bottom 0.254: v48.26,16.51 45.34,16.51 42.55,13.72 29.84,13.72 v28.83,14.73
P-D-  (via drill 0.38)
  Top 0.254: U2.11 29.19,16.15 29.72,15.62 29.72,13.84 v29.08,13.21 | v49.53,11.43 R16.1 C16.1
  Bottom 0.254: v49.53,11.43 30.86,11.43 v29.08,13.21
RAW  (via drill 0.38)
  Top 0.254: 12.7,14.1 12.7,8.89 14.22,7.37 27.05,7.37 v27.94,8.26 | J6.1 41.91,5.08 v40.64,6.35 | S2.1 11.85,16.47 | 12.7,14.1 12.06,14.1 11.81,14.35 11.81,15.21 U3.3 11.75,15.55 arc90 11.85,15.65 11.85,16.47 | 12.7,14.1 13.34,14.1 13.59,14.35 13.59,15.21 | 13.59,15.21 U3.1 | 13.59,15.21 13.59,15.49 13.65,15.55 | R7.1 11.85,16.51 11.85,16.47
  Bottom 0.254: v40.64,6.35 31.11,6.35 29.21,8.26 v27.94,8.26
RTXC1
  Top 0.254: 25.19,13.76 U2.3 | 25.19,13.76 25.19,13.25 24.38,12.45 Y2.1 | 25.19,13.76 C12.2
RTXC2
  Top 0.254: U2.5 26.19,16.03 26.04,15.88 26.04,13.34 25.53,12.83 25.53,8.8 | C13.2 25.53,8.8 | 25.53,8.8 24.38,8.8 Y2.4
RXI-0  (via drill 0.38)
  Top 0.254: v33.02,34.29 31.75,34.29 J1.4 | v31.95,21.77 32.61,21.11 U2.21
  Bottom 0.254: v33.02,34.29 33.02,22.78 32,21.77 v31.95,21.77
RXI-1  (via drill 0.38)
  Top 0.254: v40.64,30.48 40.51,30.35 31.5,30.35 31.19,30.05 U2.34
  Bottom 0.254: v40.64,30.48 52.07,30.48 53.34,29.21 53.34,6.35 54.61,5.08 J6.6
SCK0  (via drill 0.38)
  Top 0.254: v36.58,23.5 35.96,24.11 U2.27 | J3.SCLK 51.34,22.32 v50.8,22.86
  Bottom 0.254: v36.58,23.5 50.16,23.5 v50.8,22.86
SCK1  (via drill 0.38)
  Top 0.254: U2.47 24.69,27.1 v24.89,26.9
  Bottom 0.254: v24.89,26.9 24.36,26.9 17.02,19.56 17.02,4.83 16.76,4.57 13.72,4.57 12.95,3.81 12.45,3.81 11.94,3.3 8.38,3.3 J4.4
SHIELD  (via drill 0.38)
  other vias: 58.93,14.99 58.93,11.3 58.93,7.62
  pour Top (rank 2): 60.96,16.51 57.66,16.51 57.66,6.1 60.96,6.1
STAT
  Top 0.254: Q1.3 45.72,12.57 45.85,12.7 45.85,13.46 46.35,13.97 LED4.A R12.1
STAT0
  Top 0.254: LED3.C 48.77,34.17 48.77,32.51 50.8,30.48 55.88,30.48 58.42,27.94 58.42,24.13 56.52,22.23 56.52,17.65 55.88,17.02 54.48,17.02 53.09,18.41 47.62,18.41 45.72,16.51 38.73,16.51 35.05,20.19 35.05,21.08 34.52,21.61 U2.22
STAT1
  Top 0.254: LED2.C 43.94,34.17 43.94,33.53 43.43,33.02 40.64,33.02 38.48,30.86 30.23,30.86 29.69,30.32 U2.37
STOP  (via drill 0.38)
  Top 0.254: v31.62,23.11 32.12,23.61 U2.26 | v32.13,15.11 31.75,14.73 31.75,11.43 33.02,10.16 S3.3 33.02,8.26 33.66,7.62 39.37,7.62 | 39.37,7.62 C15.1 R10.1 | J5.1 39.37,7.62
  Bottom 0.254: v31.62,23.11 30.99,22.48 30.99,20.83 32.13,19.68 v32.13,15.11
TXO-0  (via drill 0.38)
  Top 0.254: v31.37,24.64 30.73,24 30.73,21.72 32.34,20.11 U2.19
  Bottom 0.254: J1.3 31.75,25.02 v31.37,24.64
TXO-1  (via drill 0.38)
  Top 0.254: v38.1,29.21 37.59,29.72 31.88,29.72 31.69,29.53 U2.33
  Bottom 0.254: v38.1,29.21 50.8,29.21 52.07,27.94 J6.5
UP_LED
  Top 0.254: U2.17 33.54,19.06 33.53,19.05 33.53,18.41 36.7,15.24 40.64,15.24 43.94,11.94 43.94,8.26 45.09,7.11 46.86,7.11 48.48,5.5 R13.1
USB_D+
  Top 0.254: 50.23,13.97 50.18,13.92 50.13,13.97 R12.2 R15.2 52.07,13.76 52.07,13.34 52.7,12.7 53.85,12.7 55.24,11.3 X1.D+
USB_D-
  Top 0.254: X1.D- 55.13,10.65 54.36,11.43 R16.2
USB_VIN  (via drill 0.38)
  Top 0.254: v14.35,6.35 v27.94,6.35 | R8.2 16.76,25.4 16,24.64 v14.88,24.64 | C17.1 R17.2 R14.2 | R14.2 51.22,7.2 | 55.12,7.33 C17.1 | X1.VBUS 55.85,10 55.24,9.4 C17.1 | R14.2 51.4,7.24 51.4,8.17 51.05,8.51 v50.29,8.51 | U1.4 11.4,28.16 11.85,28.61 C1.1 11.85,29.88 12.19,30.23 v14.73,30.23
  Bottom 0.254: 44.45,3.81 31.11,3.81 28.57,6.35 v27.94,6.35 | 44.45,3.81 48.26,3.81 50.29,5.84 v50.29,8.51 | 44.45,3.81 J6.2 | v14.35,6.35 14.35,24.11 v14.88,24.64 14.73,24.79 v14.73,30.23
VBAT  (via drill 0.38)
  Top 0.254: U2.49 22.35,26.61 v22.35,29.97
  Bottom 0.254: D101.C D100.C 12.7,33.53 12.7,32.51 13.21,32 15.24,32 17.53,29.72 21.59,29.72 21.84,29.97 v22.35,29.97
VBUS
  Top 0.254: U2.58 22.35,22.1 29.08,22.1 36.96,14.22 40.13,14.22 43.18,11.18 43.18,6.99 43.69,6.48 45.59,6.48 48.26,3.81 50.67,3.81 51.44,4.57 R14.1
VCC  (via drill 0.38)
  Top 0.254: 24.75,31.73 24.77,31.75 R2.1 | U2.23 34.79,22.11 35.31,21.59 C7.1 35.98,20.66 v36.32,20.32 | v48.13,8.89 R11.2 46.67,8.99 Q1.2 | 24.13,34.29 24.13,35.18 | 24.13,35.18 J1.6 | 27.19,19.16 U2.7 27.19,16.14 26.92,15.88 C14.1 | 27.19,19.16 27.3,19.05 v30.48,19.05 31.37,19.05 33.59,16.83 v33.59,15.24 37.34,11.49 41.59,11.49 42.12,10.96 R10.2 42.12,9.06 arc90 v42.29,8.89 | v29.21,22.99 26.29,25.91 | 26.29,25.91 26.29,27.05 26.69,27.45 U2.43 26.69,29.44 26.54,29.59 24.77,29.59 24.55,29.81 C3.1 R2.1 | 27.19,19.16 26.54,19.81 24.13,19.81 23.93,19.61 U2.63 20.88,19.61 20.32,19.05 20.32,16.51 19.05,15.24 17.53,15.24 16.93,14.64 C11.1 15.46,13.97 14.16,12.67 U3.5 13.65,11.75 14.1,11.3 C10.A | J6.3 46.99,3.81 v45.72,5.08 | 46.99,35.56 R4.1 | 46.99,35.56 46.99,31.75 49.53,29.21 55.88,29.21 56.39,28.7 56.39,27.69 | 46.99,35.56 R3.1 | C8.1 42.12,23.5 43.18,23.5 43.81,24.13 v50.8,24.13 51.51,23.42 J3.VCC 56.19,23.42 56.39,23.62 56.39,27.69 | 24.13,34.29 24.13,33.02 24.77,32.38 24.77,31.96 R2.1 | C2.1 R2.1 | R1.2 24.13,34.29 | U2.51 23.32,25.61 23.62,25.91 26.29,25.91 | v57.4,27.69 56.39,27.69 | 24.13,35.18 20.07,35.18 18.92,34.04 v18.8,34.04
  Bottom 0.254: v33.59,15.24 33.59,20.32 | v42.29,8.89 45.72,8.89 | 45.72,8.89 v48.13,8.89 | 33.59,20.32 v36.32,20.32 | 33.59,20.32 33.59,23.18 34.8,24.38 50.55,24.38 v50.8,24.13 51.56,23.37 51.56,21.08 50.89,20.41 R101.2 | v30.48,19.05 30.48,21.72 v29.21,22.99 | 45.72,8.89 v45.72,5.08 | R102.2 56.73,28.36 v57.4,27.69 56.73,27.01 R100.2 | v18.8,34.04 18.29,33.53 D100.A
VLIPO
  Top 0.254: S2.2 7.87,13.97 6.35,15.49 6.35,17.78 10.41,21.84 10.41,22.1 | U1.3 13.4,27.62 12.45,26.67 10.54,26.67 10.41,26.54 10.41,26.42 | 10.41,22.1 10.41,26.42 | 10.41,26.42 10.4,26.4 | C4.1 10.54,22.23 10.41,22.1 | J2.2 10.41,26.4 10.41,26.42
XTAL1
  Top 0.254: C6.2 18.63,18.17 Y1.3 18.93,19.95 19.09,20.11 U2.62
XTAL2
  Top 0.254: 16.64,20.61 16,20.61 C5.2 | 16.64,20.61 U2.61 | 16.64,20.61 16.64,20.7 16.63,20.71 Y1.1

### Text on the board
Bottom: v28
tPlace: 3.3V | GND | RXI0 | TXO0 | RST | BSL | STAT1 | STAT0 | RESET | CHARGE | + | - | ON | USB | OFF | STOP | Logomatic | Digital/Analog | SCK | MISO | MOSI | !CS | GND | 8 | 7 | 6 | 5 | 4 | 3 | 2 | 1 | STOP | BATT | USB | 3.3V | GND | TXO1 | RXI1
bPlace: 3.3V | GND | RXI0 | TXO0 | RST | BSL | SCK | MISO | MOSI | !CS | GND | 8 | 7 | 6 | 5 | 4 | 3 | 2 | 1 | STOP | BATT | USB | 3.3V | GND | TXO1 | RXI1
tValues: Horizontal JST
Measures: 0.13 Ø | ALL UNITS IN INCHES
tDocu: Chris Taylor | Revised by: Brent Wilkins & Toni Klopfenstein